# EAGLE schematic esquematico (EAGLE 9.6.2)
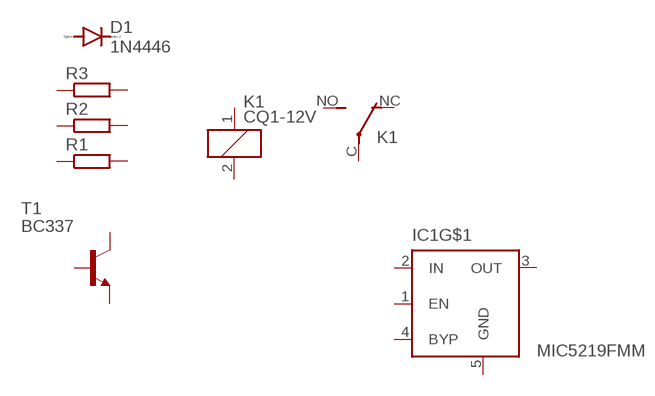
[diagram p0: schematic, sheet 1]

## Parts
D1  1N4446  [DO35-10]
IC1  MIC5219FMM  [MSOP08]
K1  CQ1-12V  [CQ1]
R1  R-EU_0207/10  [0207/10]
R2  R-EU_0207/10  [0207/10]
R3  R-EU_0207/10  [0207/10]
T1  BC337  [TO92]
Unconnected: D1.A D1.C IC1.1(EN) IC1.2(IN) IC1.3(OUT) IC1.4(BYP) K1.1 K1.2 K1.C(2:P) K1.NC(2:O) K1.NO(2:S) R1.1 R1.2 R2.1 R2.2 R3.1 R3.2 T1.1(E) T1.2(B) T1.3(C)

## Power pins joined to a net without a drawn wire
GND: IC1.5(GND) IC1.6(GND) IC1.7(GND) IC1.8(GND)

## Library data of the parts
D1 = diode:1N4446: DIODE high speed (Philips)
IC1 = v-reg-micrel:MIC5219FMM: VOLTAGE REGULATOR; OC_FARNELL: unknown; OC_NEWARK: unknown
K1 = relay:CQ1-12V: AUTOMOTIVE QUIET RELAY NAiS Source: http://www.mew-europe.com/.. en_ds_61208_0000.pdf; OC_FARNELL: unknown; OC_NEWARK: unknown
R1-R3 = rcl:R-EU_: RESISTOR, European symbol; SPICEPREFIX: R
T1 = transistor:BC337: NPN TRANSISTOR